# EasyEDA Pro project DCDC.eprj, board FSBB_隔离电源
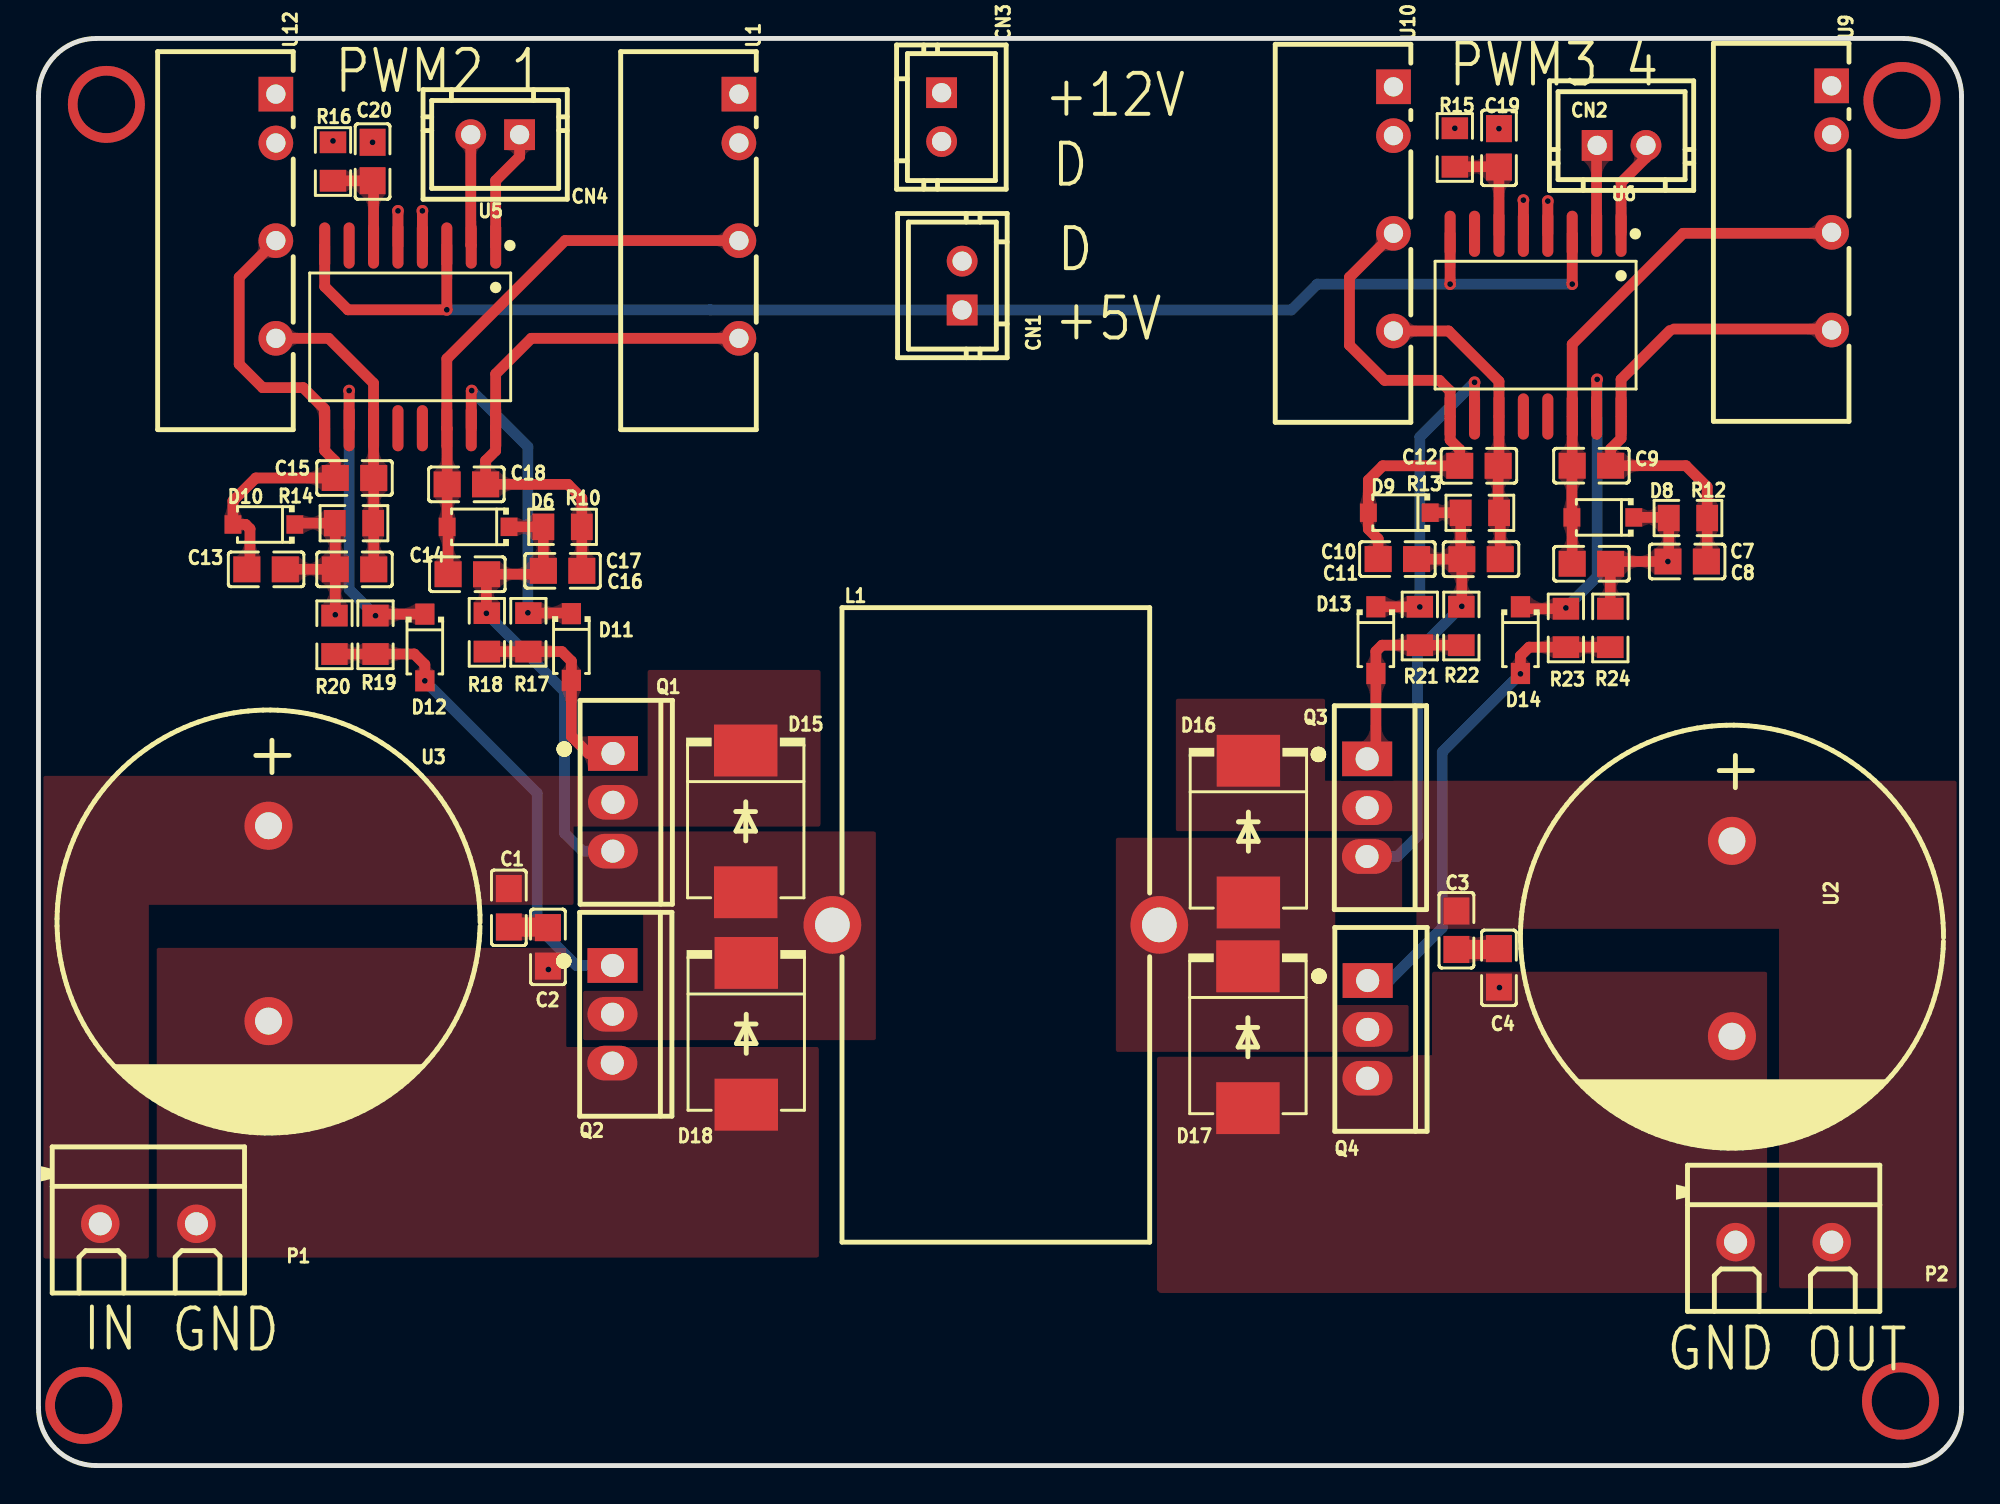
[diagram p4: board, top side]
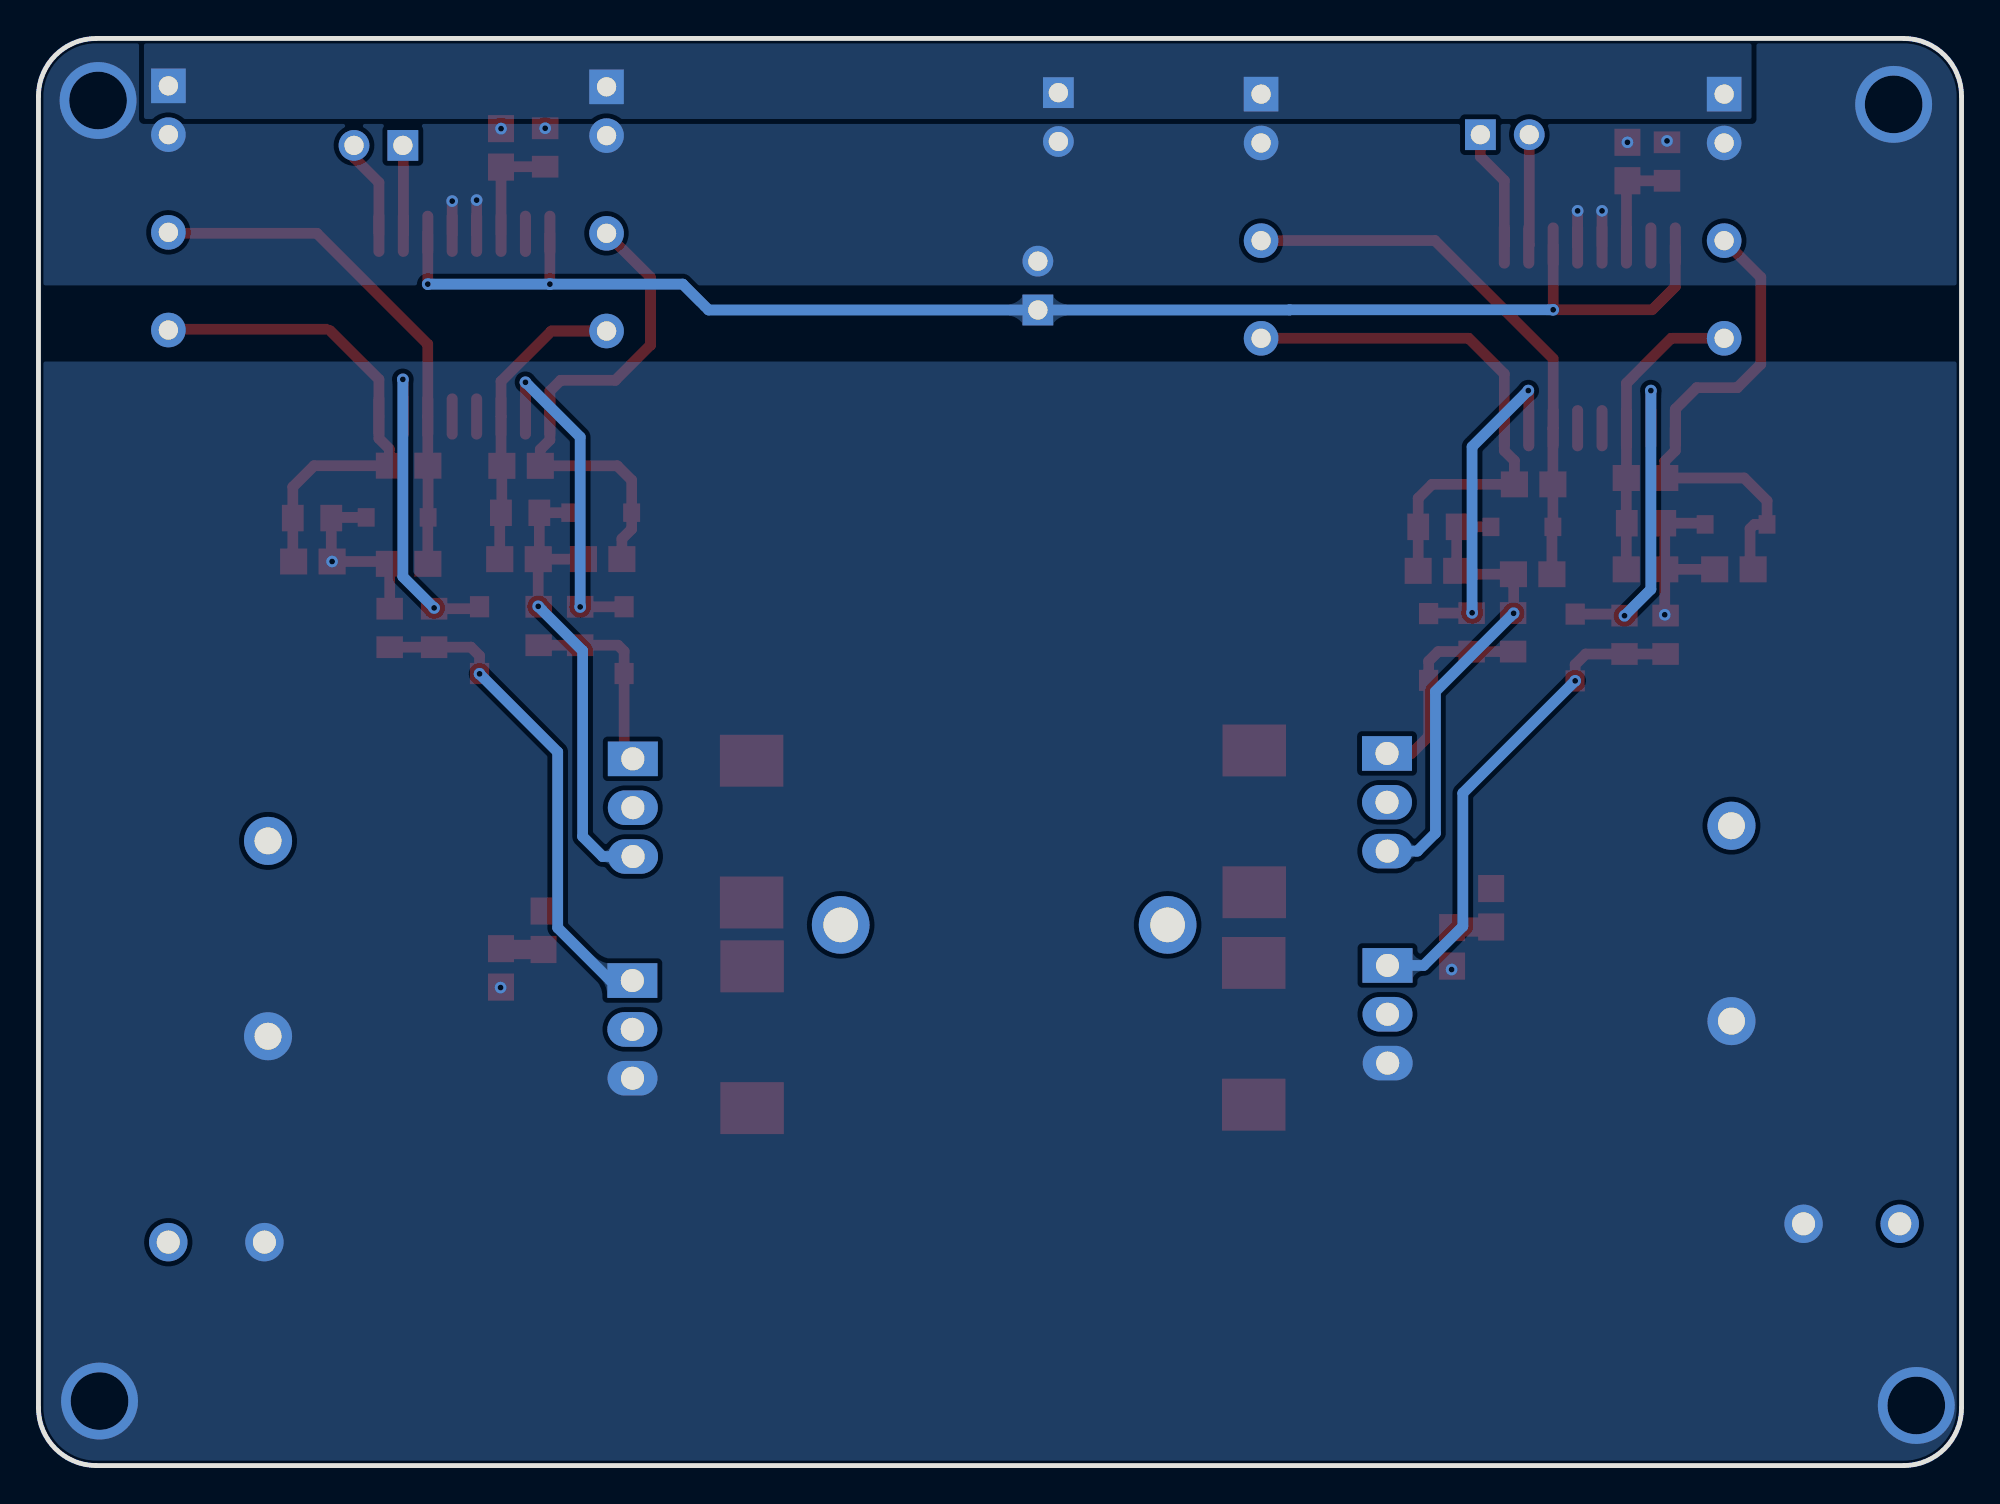
[diagram p5: board, bottom side, seen from below]

Outline 100 x 74.22 mm; copper layers: Top Layer, Bottom Layer. Coordinates in mm from the lower left corner of the outline.
Outline path: 0,71.22 0,3 arc(0.88,0.88) 3,0 97,0 arc(99.12,0.88) 100,3 100,71.22 arc(99.12,73.34) 97,74.22 3,74.22 arc(0.88,73.34) 0,71.22
Stack: Top Layer 0.035mm / Dielectric1 1.51mm FR4 er 4.5 / Bottom Layer 0.035mm

## Design rules (mm)
template: 自定义配置
spacing copperThickness1oz (default): track to track 0.102, other pairs 0.152 to 0.3
spacing copperThickness2oz: track to track 0.203, other pairs 0.152 to 0.3
track width copperThickness1oz (default): min 0.127, default 0.254, max 2.54
track width copperThickness2oz: min 0.203, default 0.254, max 2.54
differential pair differentialPair (default): width min 0.127, default 0.254, max 2.54; gap min 0.152, default 0.152
via viaSize (default): diameter min 0.5, default 0.61, max 10; hole min 0.3, default 0.305, max 6.3

## Placement (name value [footprint] x y rotation side)
C1  100nF  [C0805]  24.46 29.01 90 top
C2  100nF  [C0805]  26.49 26.98 90 top
C3  100nF  [C0805]  73.74 27.84 90 top
C4  100nF  [C0805]  75.95 25.88 90 top
C7  100nF  [C0805]  80.75 46.9 0 top
C8  100nF  [C0805]  85.73 47.02 0 top
C9  100nF  [C0805]  80.75 52 0 top
C10  100nF  [C0805]  70.66 47.14 0 top
C11  100nF  [C0805]  75.01 47.14 0 top
C12  100nF  [C0805]  74.9 51.99 0 top
C13  100nF  [C0805]  11.84 46.61 0 top
C14  100nF  [C0805]  16.43 46.61 0 top
C15  100nF  [C0805]  16.43 51.36 0 top
C16  100nF  [C0805]  22.3 46.36 0 top
C17  100nF  [C0805]  27.25 46.53 0 top
C18  100nF  [C0805]  22.25 51.03 0 top
C19  100nF  [C0805]  75.95 68.53 270 top
C20  100nF  [C0805]  17.37 67.82 270 top
CN1  CON2-2.54*2P  [CONN-TH_2P-P2.54-V]  48.03 61.37 90 top
CN2  CON2-2.54*2P  [CONN-TH_2P-P2.54-V]  82.32 68.66 0 top
CN3  CON2-2.54*2P  [CONN-TH_2P-P2.54-V]  46.96 70.13 270 top
CN4  CON2-2.54*2P  [CONN-TH_2P-P2.54-V]  23.75 69.22 180 top
D6  BZT52C9V1  [SOD-123_L2.7-W1.6-LS3.7-RD-A]  22.86 48.82 180 top
D8  BZT52C9V1  [SOD-123_L2.7-W1.6-LS3.7-RD-A]  81.35 49.31 180 top
D9  BZT52C9V1  [SOD-123_L2.7-W1.6-LS3.7-RD-A]  70.76 49.56 180 top
D10  BZT52C9V1  [SOD-123_L2.7-W1.6-LS3.7-RD-A]  11.72 48.94 180 top
D11  1N4148W  [SOD-123F_L2.7-W1.6-LS3.8-RD]  27.71 42.57 270 top
D12  1N4148W  [SOD-123F_L2.7-W1.6-LS3.8-RD]  20.09 42.55 270 top
D13  1N4148W  [SOD-123F_L2.7-W1.6-LS3.8-RD]  69.54 42.93 270 top
D14  1N4148W  [SOD-123F_L2.7-W1.6-LS3.8-RD]  77.06 42.93 270 top
D15  SK106  [SMC_L6.9-W5.9-LS7.9-RD]  36.78 33.5 270 top
D16  SK106  [SMC_L6.9-W5.9-LS7.9-RD]  62.92 32.97 270 top
D17  SK106  [SMC_L6.9-W5.9-LS7.9-RD]  62.89 22.28 270 top
D18  SK106  [SMC_L6.9-W5.9-LS7.9-RD]  36.8 22.45 270 top
L1  47uH  [IND-TH_L33.0-W16.0-P17.00-D1.5]  49.78 28.12 0 top
P1  KF301-2P接线端子  [CONN-TH_XY301V-A-5.0-2P]  5.71 12.57 180 top
P2  KF301-2P接线端子  [CONN-TH_XY301V-A-5.0-2P]  90.75 11.62 180 top
Q1  CSD19536KCS  [TO-220-3_L10.0-W4.5-P2.54-L]  29.87 34.49 270 top
Q2  CSD19536KCS  [TO-220-3_L10.0-W4.5-P2.54-L]  29.84 23.47 270 top
Q3  CSD19536KCS  [TO-220-3_L10.0-W4.5-P2.54-L]  69.09 34.21 270 top
Q4  CSD19536KCS  [TO-220-3_L10.0-W4.5-P2.54-L]  69.11 22.68 270 top
R10  600  [R0805]  27.25 48.82 0 top
R12  600  [R0805]  85.77 49.28 0 top
R13  600  [R0805]  74.95 49.55 0 top
R14  600  [R0805]  16.41 49.01 0 top
R15  10K  [R0805]  73.65 68.55 270 top
R16  10K  [R0805]  15.32 67.82 270 top
R17  2  [R0805]  25.48 43.33 270 top
R18  10K  [R0805]  23.32 43.33 270 top
R19  2  [R0805]  17.53 43.21 270 top
R20  10K  [R0805]  15.39 43.21 270 top
R21  2  [R0805]  71.83 43.66 270 top
R22  10K  [R0805]  73.99 43.66 270 top
R23  2  [R0805]  79.43 43.56 270 top
R24  10K  [R0805]  81.74 43.56 270 top
U1  B1224S-3WR2  [PWRM-TH_YLPTEC_BXXXXS-3WR2]  36.42 64.97 270 top
U2  220uF  [CAP-TH_BD22.0-P10.00-D1.4-FD]  88.06 27.41 270 top
U3  220uF  [CAP-TH_BD22.0-P10.00-D1.4-FD]  11.96 28.19 270 top
U5  UCC21520DW  [SOIC-16_L10.3-W7.5-P1.27-LS10.3-BL]  19.33 58.7 180 top
U6  UCC21520DW  [SOIC-16_L10.3-W7.5-P1.27-LS10.3-BL]  77.85 59.31 180 top
U9  B1224S-3WR2  [PWRM-TH_YLPTEC_BXXXXS-3WR2]  93.24 65.41 270 top
U10  B1224S-3WR2  [PWRM-TH_YLPTEC_BXXXXS-3WR2]  70.46 65.35 270 top
U12  B1224S-3WR2  [PWRM-TH_YLPTEC_BXXXXS-3WR2]  12.34 64.97 270 top

## Footprints (pads in the part's own frame, mm; a bottom-side part is the same pattern mirrored in y, then rotated)
C0805
  rect 1.41x1.35 smd: 1(-1,0) 2(1,0)
CAP-TH_BD22.0-P10.00-D1.4-FD
  round 2.5 hole 1.4: 1(-5.08,0) 2(5.08,0)
CONN-TH_2P-P2.54-V
  rect 1.6x1.6 hole 1: 1(-1.27,0)
  round 1.6 hole 1: 2(1.27,0)
CONN-TH_XY301V-A-5.0-2P
  round 2 hole 1.2: 1(-2.5,0) 2(2.5,0)
IND-TH_L33.0-W16.0-P17.00-D1.5
  round 3 hole 1.8: 1(-8.5,0) 2(8.5,0)
PWRM-TH_YLPTEC_BXXXXS-3WR2
  rect 1.8x1.8 hole 1: 1(-6.35,0)
  round 1.8 hole 1: 2(-3.81,0) 4(1.27,0) 6(6.35,0)
R0805
  rect 1.133x1.377 smd: 1(-1,0) 2(1,0)
SMC_L6.9-W5.9-LS7.9-RD
  rect 2.7x3.3 smd: 1(-3.687,0) 2(3.687,0)
SOD-123_L2.7-W1.6-LS3.7-RD-A
  rect 0.88x0.96 smd: 1(-1.61,0) 2(1.61,0)
SOD-123F_L2.7-W1.6-LS3.8-RD
  rect 1.1x1 smd: 1(-1.735,0) 2(1.735,0)
SOIC-16_L10.3-W7.5-P1.27-LS10.3-BL
  oval 0.574x2.401 smd: 1(-4.445,-4.75) 2(-3.175,-4.75) 3(-1.905,-4.75) 4(-0.635,-4.75) 5(0.635,-4.75) 6(1.905,-4.75) 7(3.175,-4.75) 8(4.445,-4.75) 9(4.445,4.75) 10(3.175,4.75) 11(1.905,4.75) 12(0.635,4.75) 13(-0.635,4.75) 14(-1.905,4.75) 15(-3.175,4.75) 16(-4.445,4.75)
TO-220-3_L10.0-W4.5-P2.54-L
  rect 1.8x2.6 hole 1.2: 1(-2.54,0.005)
  oval 1.8x2.6 hole 1.2: 2(0,0.005) 3(2.54,-0.005)

## Nets
As in the schematic.

Pads without a net: U5 7 12 13; U6 7 12 13

## Via types
v1: diameter 0.61, hole 0.305, Top Layer to Bottom Layer, 27 vias
v2: diameter 4, hole 3, Top Layer to Bottom Layer, 4 vias

## Routing (per net, layer and track width the routed paths; a pad name or vN(x,y) marks a point on that pad's centre or on a via; arc(x,y) is an arc through that point)
+5V: length 76.6
  Top Layer w0.559: U6.8 v1(73.41,61.44) ; U5.8 14.88,61.32 16.09,60.11 v1(21.23,60.11) U5.3 ; v1(79.76,61.44) U6.3
  Bottom Layer w0.559: v1(79.76,61.44) v1(73.41,61.44) 66.5,61.44 65.15,60.1 CN1.1 34.94,60.1 34.93,60.11 v1(21.23,60.11)
GND: length 7.1
  Top Layer w0.559: U6.4 v1(78.49,65.76) ; U5.5 v1(18.69,65.25) ; U6.5 v1(77.22,65.81) ; U5.4 v1(19.96,65.25)
  vias: v1(15.32,68.89) v1(17.37,68.82) v1(73.65,69.55) v1(75.95,69.53) v2(3.53,70.79) v2(96.9,70.99)
PGND: length 19
  Top Layer w0.559: C13.2 C14.1 ; C14.1 v1(15.43,44.25) R20.1 ; C14.1 15.43,48.98 R14.1 13.4,49.01 D10.1 ; R24.1 81.74,46.88 C7.2 81.87,47.02 v1(84.73,47.02) 84.77,47.06 R12.1 84.74,49.31 D8.1
  vias: v1(26.52,25.8) v1(75.97,24.86) v2(2.35,3.12) v2(96.82,3.35)
G1: length 11
  Top Layer w0.559: Q1.1 28.6,37.03 27.71,37.92 D11.2 27.71,41.83 27.21,42.33 R17.2 R18.2
G2: length 25.7
  Top Layer w0.559: R20.2 R19.2 19.54,42.21 20.09,41.66 v1(20.09,40.81)
  Bottom Layer w0.559: Q2.1 27.97,26.01 25.93,28.04 25.93,34.97 v1(20.09,40.81)
G3: length 10.4
  Top Layer w0.559: R22.2 R21.2 69.87,42.66 69.54,42.34 D13.2 69.54,37.21 Q3.1
G4: length 25.7
  Top Layer w0.559: v1(77.06,41.17) D14.2 77.06,42.11 77.51,42.56 R23.2 R24.2
  Bottom Layer w0.559: v1(77.06,41.17) 73,37.11 73,27.97 70.26,25.22 Q4.1
PWM1: length 6.3
  Top Layer w0.559: U5.1 23.77,66.83 25.02,68.07 CN4.1
PWM2: length 5.8
  Top Layer w0.559: CN4.2 22.48,63.48 U5.2
PWM3: length 4.9
  Top Layer w0.559: U6.2 81.02,64.06 81.02,68.91 81.05,68.94
PWM4: length 5.4
  Top Layer w0.559: 83.59,68.94 83.59,68.02 82.3,66.73 U6.1
S1: length 17
  Top Layer w0.559: v1(22.53,55.91) 22.5,55.88 U5.15 ; R17.1 27.68,44.33 D11.1
  Bottom Layer w0.559: v1(25.45,44.35) 25.45,52.98 v1(22.53,55.91)
S2: length 16.8
  Top Layer w0.559: D12.1 17.6,44.28 17.52,44.2 ; U5.10 v1(16.15,55.91)
  Bottom Layer w0.559: v1(17.53,44.2) 16.15,45.57 v1(16.15,55.91)
S3: length 16.9
  Top Layer w0.559: D13.1 71.83,44.66 ; 74.68,54.56 v1(74.68,56.34)
  Bottom Layer w0.559: v1(74.68,56.34) 71.83,53.49 v1(71.83,44.65)
S4: length 16.9
  Top Layer w0.559: R23.1 77.16,44.56 D14.1 ; 81.03,54.56 81.03,56.46 v1(81.05,56.49)
  Bottom Layer w0.559: v1(81.05,56.49) 81.05,46.23 v1(79.43,44.6)
VS1: length 25.1
  Top Layer w0.559: v1(23.29,44.32) 23.29,46.35 C16.2 26.08,46.36 C17.1 R10.1 D6.1
  Bottom Layer w0.559: Q1.3 28.3,31.95 27.36,32.89 27.36,40.26 v1(23.29,44.32)
VS2: length 24.8
  Top Layer w0.559: D9.1 73.95,49.56 R13.1 73.95,47.2 C11.1 ; C11.1 v1(74.01,44.69) R22.1 ; C11.1 71.67,47.14 C10.2
  Bottom Layer w0.559: v1(74.01,44.69) 71.7,42.38 71.7,32.72 70.66,31.67 Q3.3
$1N1312: length 2.1
  Top Layer w1: C1.1 26.49,28.01 26.52,27.98
$1N1346: length 2.2
  Top Layer w1: C4.2 75.9,26.84 C3.1
$1N2910: length 29
  Top Layer w0.559: 21.25,48.82 C18.1 21.25,53.93 U5.14 21.23,57.56 27.39,63.71 36.42,63.71 U1.4 ; C16.1 21.3,48.77 D6.2
$1N2914: length 28.2
  Top Layer w0.559: 79.74,51.72 79.74,51.98 C9.1 ; 79.74,51.72 79.76,51.74 79.76,58.32 85.52,64.08 93.78,64.08 93.83,64.14 ; 79.74,51.72 D8.2 79.75,49.3 C7.1
$1N2919: length 15.9
  Top Layer w0.559: C11.2 76.01,49.49 R13.2 75.9,49.6 C12.2 75.95,52.04 75.95,56.39 73.33,59 U10.6
$1N2920: length 26.5
  Top Layer w0.559: C10.1 69.66,48.19 69.15,48.7 D9.2 69.15,51.25 69.9,51.99 C12.1 73.9,52.84 73.41,53.34 73.41,55.88 72.85,56.44 70,56.44 68.17,58.27 68.17,61.8 U10.4
$1N2926: length 26.6
  Top Layer w0.559: C13.1 11,46.77 11,48.72 10.77,48.94 D10.2 10.11,50.17 11.3,51.36 C15.1 15.43,52.23 14.88,52.78 U5.9 14.88,53.96 14.88,54.95 13.77,56.06 11.66,56.06 10.44,57.28 10.44,61.8 U12.4
$1N2976: length 15.8
  Top Layer w0.559: U12.6 15.09,58.62 17.42,56.29 U5.11 17.42,51.37 C15.2 17.43,49.04 R14.2 17.43,48.98 C14.2
$1N2985: length 28.5
  Top Layer w0.559: U1.6 25.63,58.62 23.77,56.77 U5.16 23.77,52.78 23.25,52.26 C18.2 27.53,51.03 28.25,50.31 R10.2 C17.2
$1N4042: length 26.5
  Top Layer w0.559: C8.2 86.77,47.06 R12.2 86.77,50.89 85.67,52 C9.2 81.75,52.87 82.3,53.42 82.3,56.49 84.84,59.03 ; 93.83,59.06 93.78,59.11 85.04,59.11
$1N4259: length 5.4
  Top Layer w0.559: U5.6 17.42,66.77 C20.2 R16.2
$1N4305: length 5.8
  Top Layer w0.559: U6.6 C19.2 75.93,67.55 R15.2

## Copper pours and planes (outline as drawn; the poured copper is in the pictures)
+12V on Bottom Layer: 10.92,74.22 94.51,74.22 94.51,70.03 10.92,70.03
GND on Bottom Layer: 0.05,74.24 101.22,74.24 101.22,61.38 0.05,61.38
PGND on Top Layer: 6.15,10.82 6.15,26.92 27.45,26.92 27.45,21.8 27.48,21.77 40.58,21.77 40.58,10.82
PGND on Top Layer: 58.22,21.34 72.47,21.34 72.47,25.68 89.89,25.68 89.89,8.97 58.31,8.97 58.17,9.12 58.17,21.29
PGND on Bottom Layer: 0,57.42 100.03,57.42 100.03,-0.61 0,-0.61
VDC on Top Layer: 5.74,10.77 5.74,29.16 27.83,29.16 27.83,33.24 40.67,33.24 40.67,41.38 31.67,41.38 31.67,35.87 0,35.87 0,10.82 0.05,10.77
VOUT on Top Layer: 90.51,9.22 90.51,27.9 90.5,27.91 71.65,27.91 71.65,33 59.18,33 59.14,32.96 59.14,39.88 66.88,39.88 66.9,39.9 66.9,35.64 66.93,35.61 100,35.61 100,9.22
VS1 on Top Layer: 28.15,32.98 28.15,28.89 31.44,28.89 31.44,24.69 28.32,24.69 28.32,22.12 43.54,22.12 43.54,32.98
VS2 on Top Layer: 70.91,32.65 70.91,28.89 67.44,28.89 67.44,23.95 71.25,23.95 71.25,21.51 56.02,21.51 56.02,32.65

Small or netless copper shapes (teardrops, artwork), in the pictures only: 179 on Top Layer, 22 on Bottom Layer

## Text on the board
Top Silkscreen Layer: PWM2 1 | +12V | D | +5V | PWM3 4 | IN | GND | OUT
